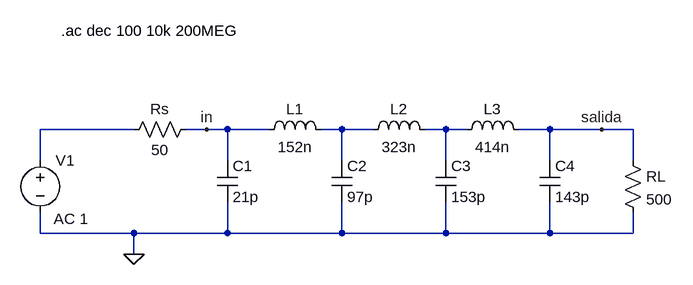
[diagram p0: schematic Filtro Pasabajos.asc]
Filtro Pasabajos.asc, the LTspice schematic file:
Version 4
SHEET 1 880 708
WIRE -80 176 -224 176
WIRE 32 176 0 176
WIRE 64 176 32 176
WIRE 128 176 64 176
WIRE 240 176 208 176
WIRE 288 176 240 176
WIRE 400 176 368 176
WIRE 432 176 400 176
WIRE 560 176 512 176
WIRE 640 176 560 176
WIRE 688 176 640 176
WIRE -224 224 -224 176
WIRE 64 224 64 176
WIRE 240 224 240 176
WIRE 400 224 400 176
WIRE 560 224 560 176
WIRE 688 224 688 176
WIRE -224 336 -224 304
WIRE -80 336 -224 336
WIRE 64 336 64 288
WIRE 64 336 -80 336
WIRE 240 336 240 288
WIRE 240 336 64 336
WIRE 400 336 400 288
WIRE 400 336 240 336
WIRE 560 336 560 288
WIRE 560 336 400 336
WIRE 688 336 688 304
WIRE 688 336 560 336
WIRE -80 368 -80 336
FLAG -80 368 0
FLAG 32 176 in
FLAG 640 176 salida
SYMBOL res -96 192 R270
WINDOW 0 32 56 VTop 0
WINDOW 3 0 56 VBottom 0
SYMATTR InstName Rs
SYMATTR Value 50
SYMBOL ind 112 192 R270
WINDOW 0 32 56 VTop 0
WINDOW 3 5 56 VBottom 0
SYMATTR InstName L1
SYMATTR Value 152n
SYMBOL ind 272 192 R270
WINDOW 0 32 56 VTop 0
WINDOW 3 5 56 VBottom 0
SYMATTR InstName L2
SYMATTR Value 323n
SYMBOL ind 416 192 R270
WINDOW 0 32 56 VTop 0
WINDOW 3 5 56 VBottom 0
SYMATTR InstName L3
SYMATTR Value 414n
SYMBOL res 672 208 R0
SYMATTR InstName RL
SYMATTR Value 500
SYMBOL cap 544 224 R0
SYMATTR InstName C4
SYMATTR Value 143p
SYMBOL cap 384 224 R0
SYMATTR InstName C3
SYMATTR Value 153p
SYMBOL cap 224 224 R0
SYMATTR InstName C2
SYMATTR Value 97p
SYMBOL cap 48 224 R0
SYMATTR InstName C1
SYMATTR Value 21p
SYMBOL voltage -224 208 R0
WINDOW 123 21 106 Left 0
WINDOW 39 0 0 Left 0
SYMATTR Value2 AC 1
SYMATTR InstName V1
SYMATTR Value ""
TEXT -192 24 Left 0 !.ac dec 100 10k 200MEG

The netlist it stands for:
* Filtro Pasabajos.asc
Rs N001 in 50
L1 in N002 152n
L2 N002 N003 323n
L3 N003 salida 414n
RL salida 0 500
C4 salida 0 143p
C3 N003 0 153p
C2 N002 0 97p
C1 in 0 21p
V1 N001 0 AC 1
.ac dec 100 10k 200MEG
.backanno
.end